# EAGLE design Modem (EAGLE 7.1.0)
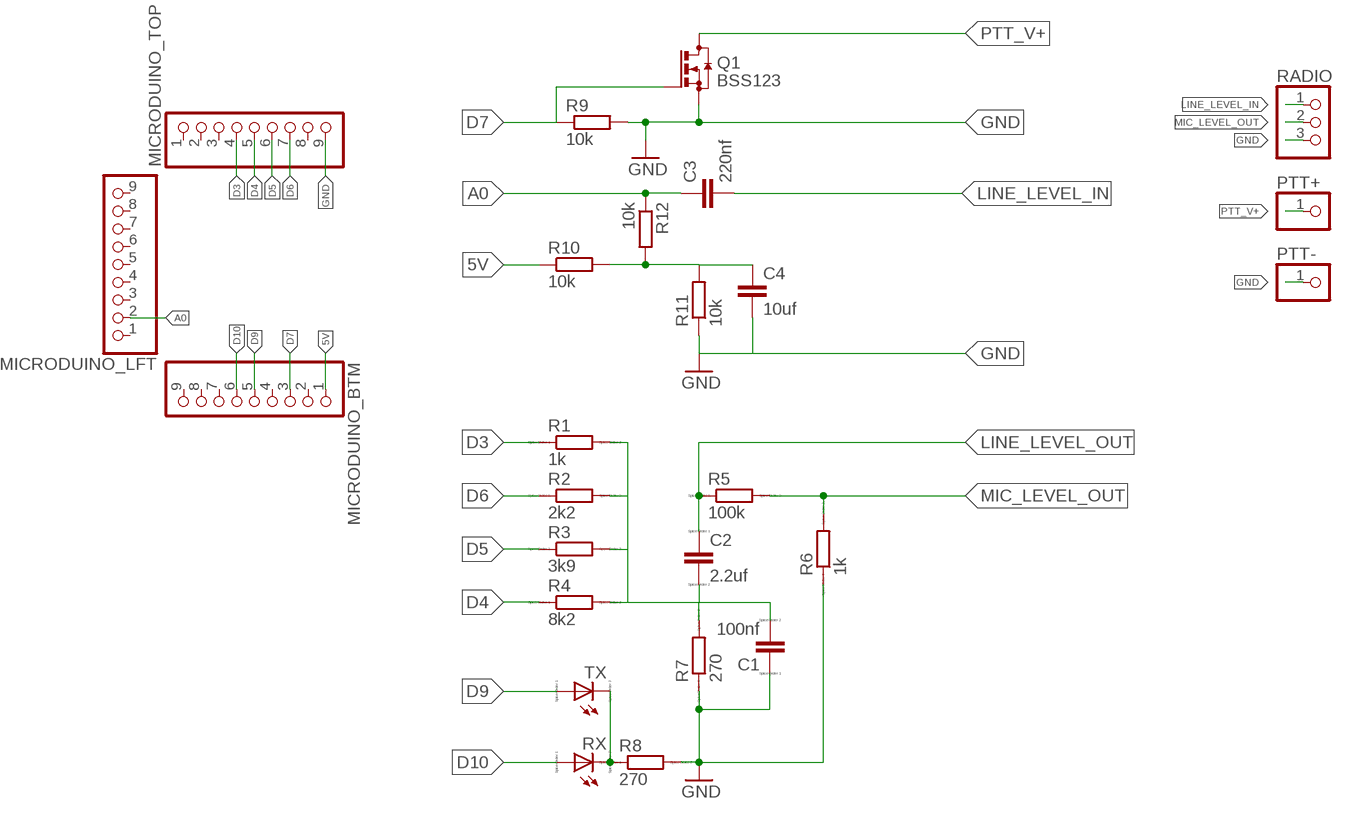
[diagram p0: schematic, sheet 1]

## Parts
C1  100nf  CC0603  [C0603]
C2  2.2uf  CC1206  [C1206]
C3  220nf  C-EUC0603  [C0603]
C4  10uf  C-EUC1206  [C1206]
MICRODUINO_BTM  PINHD-1X9  [1X09-BIG]
MICRODUINO_LFT  PINHD-1X9  [1X09-BIG]
MICRODUINO_TOP  PINHD-1X9  [1X09-BIG]
PTT+  PINHD-1X1  [1X01]
PTT-  PINHD-1X1  [1X01]
Q1  BSS123  [SOT23]
R1  1k  R-EU_R0603  [R0603]
R2  2k2  R-EU_R0603  [R0603]
R3  3k9  R-EU_R0603  [R0603]
R4  8k2  R-EU_R0603  [R0603]
R5  100k  R-EU_R0603  [R0603]
R6  1k  R-EU_R0603  [R0603]
R7  270  R-EU_R0603  [R0603]
R8  270  R-EU_R0603  [R0603]
R9  10k  R-EU_R0603  [R0603]
R10  10k  R-EU_R0603  [R0603]
R11  10k  R-EU_R0603  [R0603]
R12  10k  R-EU_R0603  [R0603]
RADIO  PINHD-1X3  [1X03]
RX  LED_E  [LED_1206]
TX  LED_E  [LED_1206]

## Nets
5V: MICRODUINO_BTM.1 R10.1
A0: C3.1 MICRODUINO_LFT.2 R12.1
D3: MICRODUINO_TOP.4 R1.1
D4: MICRODUINO_TOP.5 R4.1
D5: MICRODUINO_TOP.6 R3.1
D6: MICRODUINO_TOP.7 R2.1
D7: MICRODUINO_BTM.3 Q1.1(G) R9.1
D9: MICRODUINO_BTM.5 TX.A
D10: MICRODUINO_BTM.6 RX.A
GND: C1.1 C4.2 MICRODUINO_TOP.9 PTT-.1 Q1.2(S) R6.1 R7.1 R8.2 R9.2 R11.1 RADIO.3
LINE_LEVEL_IN: C3.2 RADIO.1
LINE_LEVEL_OUT: C2.1 R5.1
MIC_LEVEL_OUT: R5.2 R6.2 RADIO.2
N$1: R8.1 RX.C TX.C
N$5: C1.2 C2.2 R1.2 R2.2 R3.2 R4.2 R7.2
N$10: C4.1 R10.2 R11.2 R12.2
PTT_V+: PTT+.1 Q1.3(D)
Unconnected: MICRODUINO_BTM.2 MICRODUINO_BTM.4 MICRODUINO_BTM.7 MICRODUINO_BTM.8 MICRODUINO_BTM.9 MICRODUINO_LFT.1 MICRODUINO_LFT.3 MICRODUINO_LFT.4 MICRODUINO_LFT.5 MICRODUINO_LFT.6 MICRODUINO_LFT.7 MICRODUINO_LFT.8 MICRODUINO_LFT.9 MICRODUINO_TOP.1 MICRODUINO_TOP.2 MICRODUINO_TOP.3 MICRODUINO_TOP.8

## Library data of the parts
C1 C2 = eagle-ltspice:C: CAPACITOR, European symbol; SPICEMODEL: NONE; SPICEPREFIX: C
C3 C4 = rcl:C-EU: CAPACITOR, European symbol
MICRODUINO_BTM MICRODUINO_LFT MICRODUINO_TOP = adafruit:PINHD-1X9: Pin header 1x10 0.1" spacing With round pins
PTT+ PTT- = adafruit:PINHD-1X1: Pin header 1x1 for 0.1" spacing With round pins
Q1 = transistor-small-signal:BSS123: N-CHANNEL MOS FET
R1-R8 = resistor:R-EU_: RESISTOR, European symbol; SPICEPREFIX: R
R9-R12 = rcl:R-EU_: RESISTOR, European symbol
RADIO = adafruit:PINHD-1X3: PIN HEADER
RX TX = eagle-ltspice:LED_E: LED Source: http://www.osram.convergy.de Source: www.luxeon.com Source: www.kingbright.com; SPICEMODEL: NONE; SPICEPREFIX: D; SPICETYPE: diode

## Board
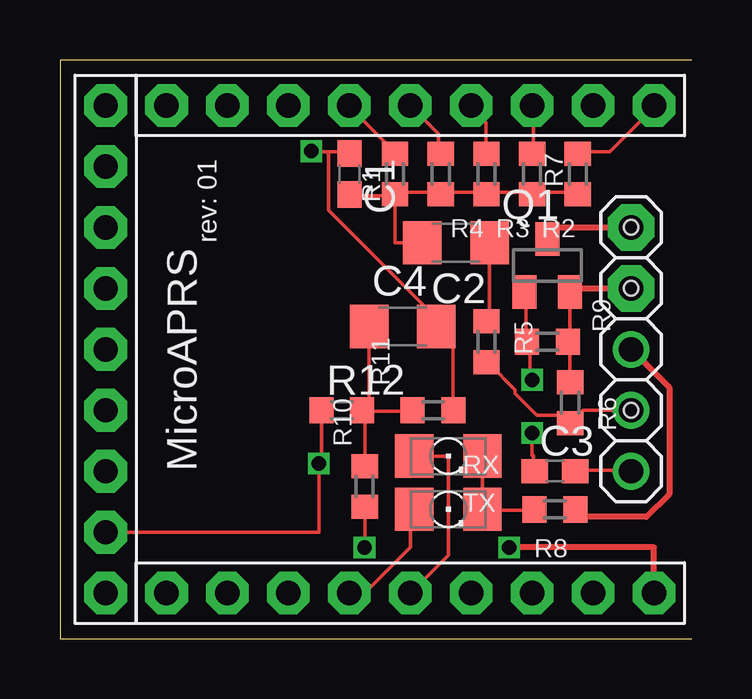
[diagram p1: board, top side]
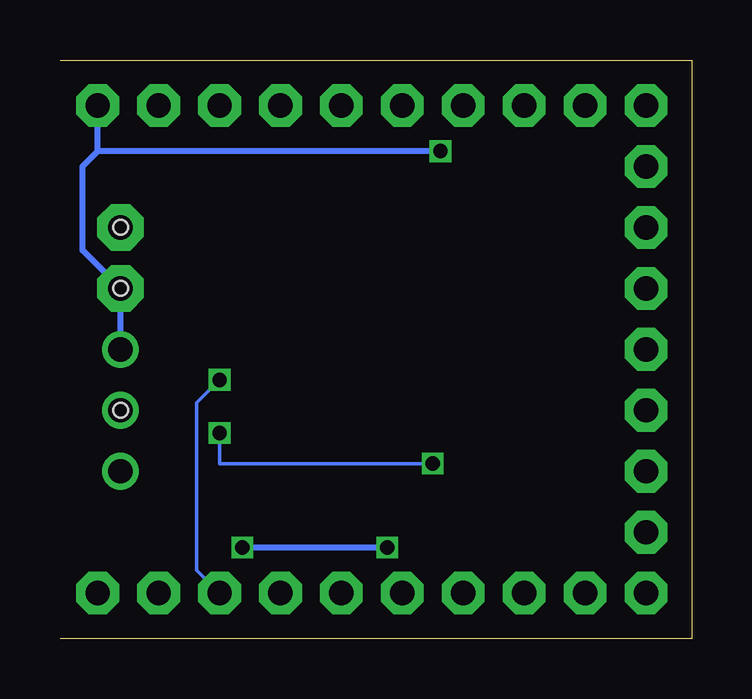
[diagram p2: board, bottom side, seen from below]

Size 26.34 x 24.12 mm. Coordinates in mm from the lower left corner, seen from the top.
Outline: 26.34,0 0,0 0,24.12 26.34,24.12
Copper layers (1*16): Top 0.035mm / dielectric 1.5mm / Bottom 0.035mm
Design rules "SeeedStudio_2layer_DRU_no_angle_20140221": minimum track width 6mil, minimum drill 12mil, track to track 6mil, track to pad 6mil, pad to pad 6mil, via to via 6mil, smd to smd 0mil, copper to edge 10mil, drill to drill 10mil, minimum pad ring 10mil, minimum via ring 6mil, stop-mask expansion 2mil, vias tented up to drill 100mil, thermal gap 10mil
Holes 0.6 mm at 23.81,14.6 23.81,17.15 23.81,9.52

### Footprints (pad centres in the part's own frame; a part is rotated, then mirrored left to right if it is on the bottom)
C0603 = smd 1.1 x 1: 1 -0.85,0; 2 0.85,0
C1206 = smd 1.6 x 1.8: 1 -1.4,0; 2 1.4,0
1X09-BIG = drill 1.016 pad 1.778 octagon: 1 -10.16,0; 2 -7.62,0; 3 -5.08,0; 4 -2.54,0; 5 0,0; 6 2.54,0; 7 5.08,0; 8 7.62,0; 9 10.16,0
1X01 = drill 1.016 pad 1.93 octagon: 1 0,0
SOT23 = smd 1 x 1.4: 1 -0.95,-1.1; 2 0.95,-1.1; 3 0,1.1
R0603 = smd 1 x 1.1: 1 -0.85,0; 2 0.85,0
1X03 = drill 1.016: 1 -2.54,0; 2 0,0; 3 2.54,0
LED_1206 = smd 1.6 x 1.803: A -1.422,0; C 1.422,0

### Placement (x,y rotation side)
C1  12.07,19.37 270 top
C2  16.51,16.51 180 top
C3  20.64,6.98 0 top
C4  14.29,13.02 0 top
MICRODUINO_BTM  14.61,1.9 180 top
MICRODUINO_LFT  1.91,12.06 90 top
MICRODUINO_TOP  14.61,22.23 0 top
PTT+  23.81,17.15 90 top
PTT-  23.81,14.6 90 top
Q1  20.32,15.56 0 top
R1  13.97,19.37 270 top
R2  19.68,19.37 270 top
R3  17.78,19.37 270 top
R4  15.88,19.37 270 top
R5  17.78,12.38 270 top
R6  21.27,9.84 270 top
R7  21.59,19.37 270 top
R8  20.64,5.4 0 top
R9  20.32,12.38 0 top
R10  12.7,6.35 90 top
R11  15.56,9.52 180 top
R12  11.75,9.52 0 top
RADIO  23.81,9.52 90 top
RX  16.19,5.4 0 top
TX  16.19,7.62 0 top

### Tracks (layer width: path | path; a pad name or v marks a point on that pad's centre or on a via)
5V  (via drill 0.6)
  Top 0.152: R10.1 12.73,5.36 12.73,3.83 v12.7,3.81
  Top 0.254: MICRODUINO_BTM.1 24.76,3.81 v18.73,3.81
  Bottom 0.254: v18.73,3.81 v12.7,3.81
A0  (via drill 0.6)
  Top 0.152: 19.74,7.64 19.74,7.34 C3.1 19.74,7.64 | MICRODUINO_LFT.2 10.8,4.45 v10.8,7.3 10.9,7.34 10.9,9.47 R12.1 | 19.74,7.64 19.68,7.64 v19.68,8.57
  Bottom 0.152: v10.8,7.3 19.68,7.3 v19.68,8.57
D3
  Top 0.152: R1.1 13.95,20.29 12.12,22.12 MICRODUINO_TOP.4
D4
  Top 0.152: MICRODUINO_TOP.5 15.77,21.06 15.77,20.29 R4.1
D5
  Top 0.152: R3.1 17.75,20.29 17.75,21.51 17.14,22.12 MICRODUINO_TOP.6
D6
  Top 0.152: R2.1 19.74,20.29 19.74,22.12 MICRODUINO_TOP.7
D7  (via drill 0.6)
  Top 0.152: Q1.1 19.43,14.35 19.43,12.52 R9.1 19.58,12.22 19.58,10.85 v19.68,10.79
  Top 0.254: Q1.1 19.47,14.36 | R9.1 19.58,12.27
  Bottom 0.152: MICRODUINO_BTM.3 20.64,2.86 20.64,9.84 v19.68,10.79
D9
  Top 0.152: MICRODUINO_BTM.5 16.19,3.49 16.19,7.62 TX.A
D10
  Top 0.152: MICRODUINO_BTM.6 12.7,1.9 14.61,3.81 14.61,5.23 RX.A
GND  (via drill 0.6)
  Top 0.152: R7.1 21.72,20.29 22.94,20.29 24.76,22.12 MICRODUINO_TOP.9 | 21.41,14.5 Q1.2 21.26,14.35 21.26,12.52 R9.2 21.26,12.37 21.26,10.69 R6.1 | 11.2,20.29 10.59,20.29 v10.48,20.32 | 11.2,20.29 11.96,20.29 C1.1 | 11.2,20.29 11.2,17.86 15.62,13.44 15.62,13.13 C4.2 15.77,12.98 16.38,12.37 16.38,9.63 R11.1 | 21.87,5.36 21.57,5.36 | 21.54,5.05 21.56,5.06 | 21.56,5.06 21.59,5.08 | 21.57,5.36 21.57,5.05 21.56,5.06 | 21.57,5.36 R8.2
  Top 0.254: 21.41,14.5 21.51,14.6 PTT-.1 | RADIO.3 25.4,10.48 25.4,6.03 24.45,5.08 21.59,5.08 | 21.59,5.71 R8.2
  Bottom 0.254: RADIO.3 PTT-.1 25.4,16.19 25.4,19.68 24.76,20.32 | 24.76,20.32 MICRODUINO_TOP.9 | v10.48,20.32 24.76,20.32
LINE_LEVEL_IN
  Top 0.152: C3.2 21.57,7.04 23.7,7.04 RADIO.1
LINE_LEVEL_OUT
  Top 0.152: R5.1 17.91,13.28 17.91,16.48 C2.1
MIC_LEVEL_OUT
  Top 0.152: RADIO.2 21.81,9.52 R6.2 21.26,9.02 20.96,9.32 19.89,9.32 18.97,10.24 18.97,10.39 17.91,11.45 R5.2
N$1
  Top 0.152: TX.C RX.C 17.75,5.36 19.74,5.36 R8.1
N$5
  Top 0.152: R7.2 21.57,18.62 19.74,18.62 R2.2 19.58,18.62 17.91,18.62 R3.2 17.75,18.62 15.93,18.62 R4.2 15.77,18.62 14.1,18.62 | C1.2 12.12,18.47 13.95,18.47 R1.2 14.1,18.62 | 15.16,16.64 C2.2 13.97,16.51 13.97,18.62 14.1,18.62
N$10
  Top 0.152: 12.88,9.47 14.71,9.47 R11.2 | 12.88,9.47 12.73,9.47 | 12.73,9.47 12.73,7.34 R10.2 | 12.73,9.47 R12.2 12.88,9.47 | 12.88,9.47 12.88,12.98 C4.1
PTT_V+
  Top 0.254: Q1.3 20.81,17.15 PTT+.1

### Text on the board
tPlace: rev: 01 | MicroAPRS